# Altium schematic sheet UV.SchDoc: UV Sensor
size A4; DocumentNumber: 8; Revision: 0v1; SheetNumber: 8; SheetTotal: 9
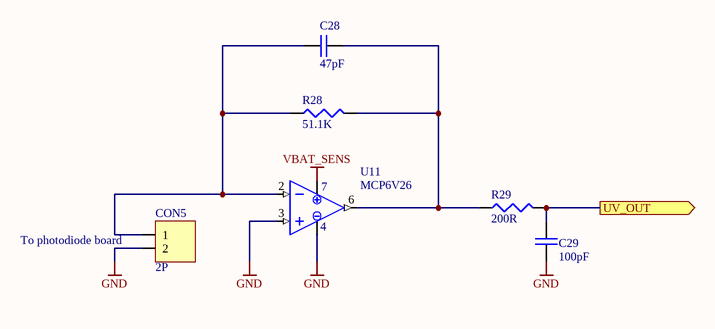
[diagram p0: UV.SchDoc]

## Parts
C28  47pF  [0603]
C29  100pF  [0603]
CON5  2P  [INTERLOCK2-5MM-FIXED]
R28  51.1K  [0603]
R29  200R  [0603]
U11  MCP6V26  [SOIC-8]

## Ports
UV_OUT (out)

## Nets
GND: C29.1 CON5.2 U11.3(INP) U11.4(VSS)
VBAT_SENS: U11.7(VDD)
UV_OUT: C29.2 R29.2 ; port UV_OUT
NetC28_1: C28.1 CON5.1 R28.1 U11.2(INN)
NetC28_2: C28.2 R28.2 R29.1 U11.6(VOUT)

## Notes on the sheet
- (near CON5) To photodiode board
- Title
- Size:
- Date:
- A4
- Number:
- Time:
- Revision:
- Sheet
- of
- File:

## Library data of the parts
C28 C29 = CAP: Capacitor; Owner: Nuno Brum; Sub-Type: Ceramic; Assembly: INS; Maximum Voltage: *; Creation Date: 2005-04-28; Status: Valid; Validation date: 2006-05-15; Type: Capacitor
CON5 = CON02: Connector 2 pins; Owner: Rui Rebelo; Assembly: INS; Sub-Type: Connector; Creation Date: 2005-05-27; Status: Valid; Validation Date: 2006-05-15; Type: Electrical & Mechanical
R28 R29 = RES: Resistor; Owner: Nuno Brum; Sub-Type: Generic; Assembly: INS; Validation date: 2006-05-15; Creation Date: 2002-07-17; Status: Valid; Power: *; Type: Resistor
U11 = MCP6V26: Low-Offset Opamp; Type: IC; Creation Date: 2012-03-15